# Altium schematic sheet SIM800C_L70.SchDoc
size A3; SheetNumber: 3; SheetTotal: 4
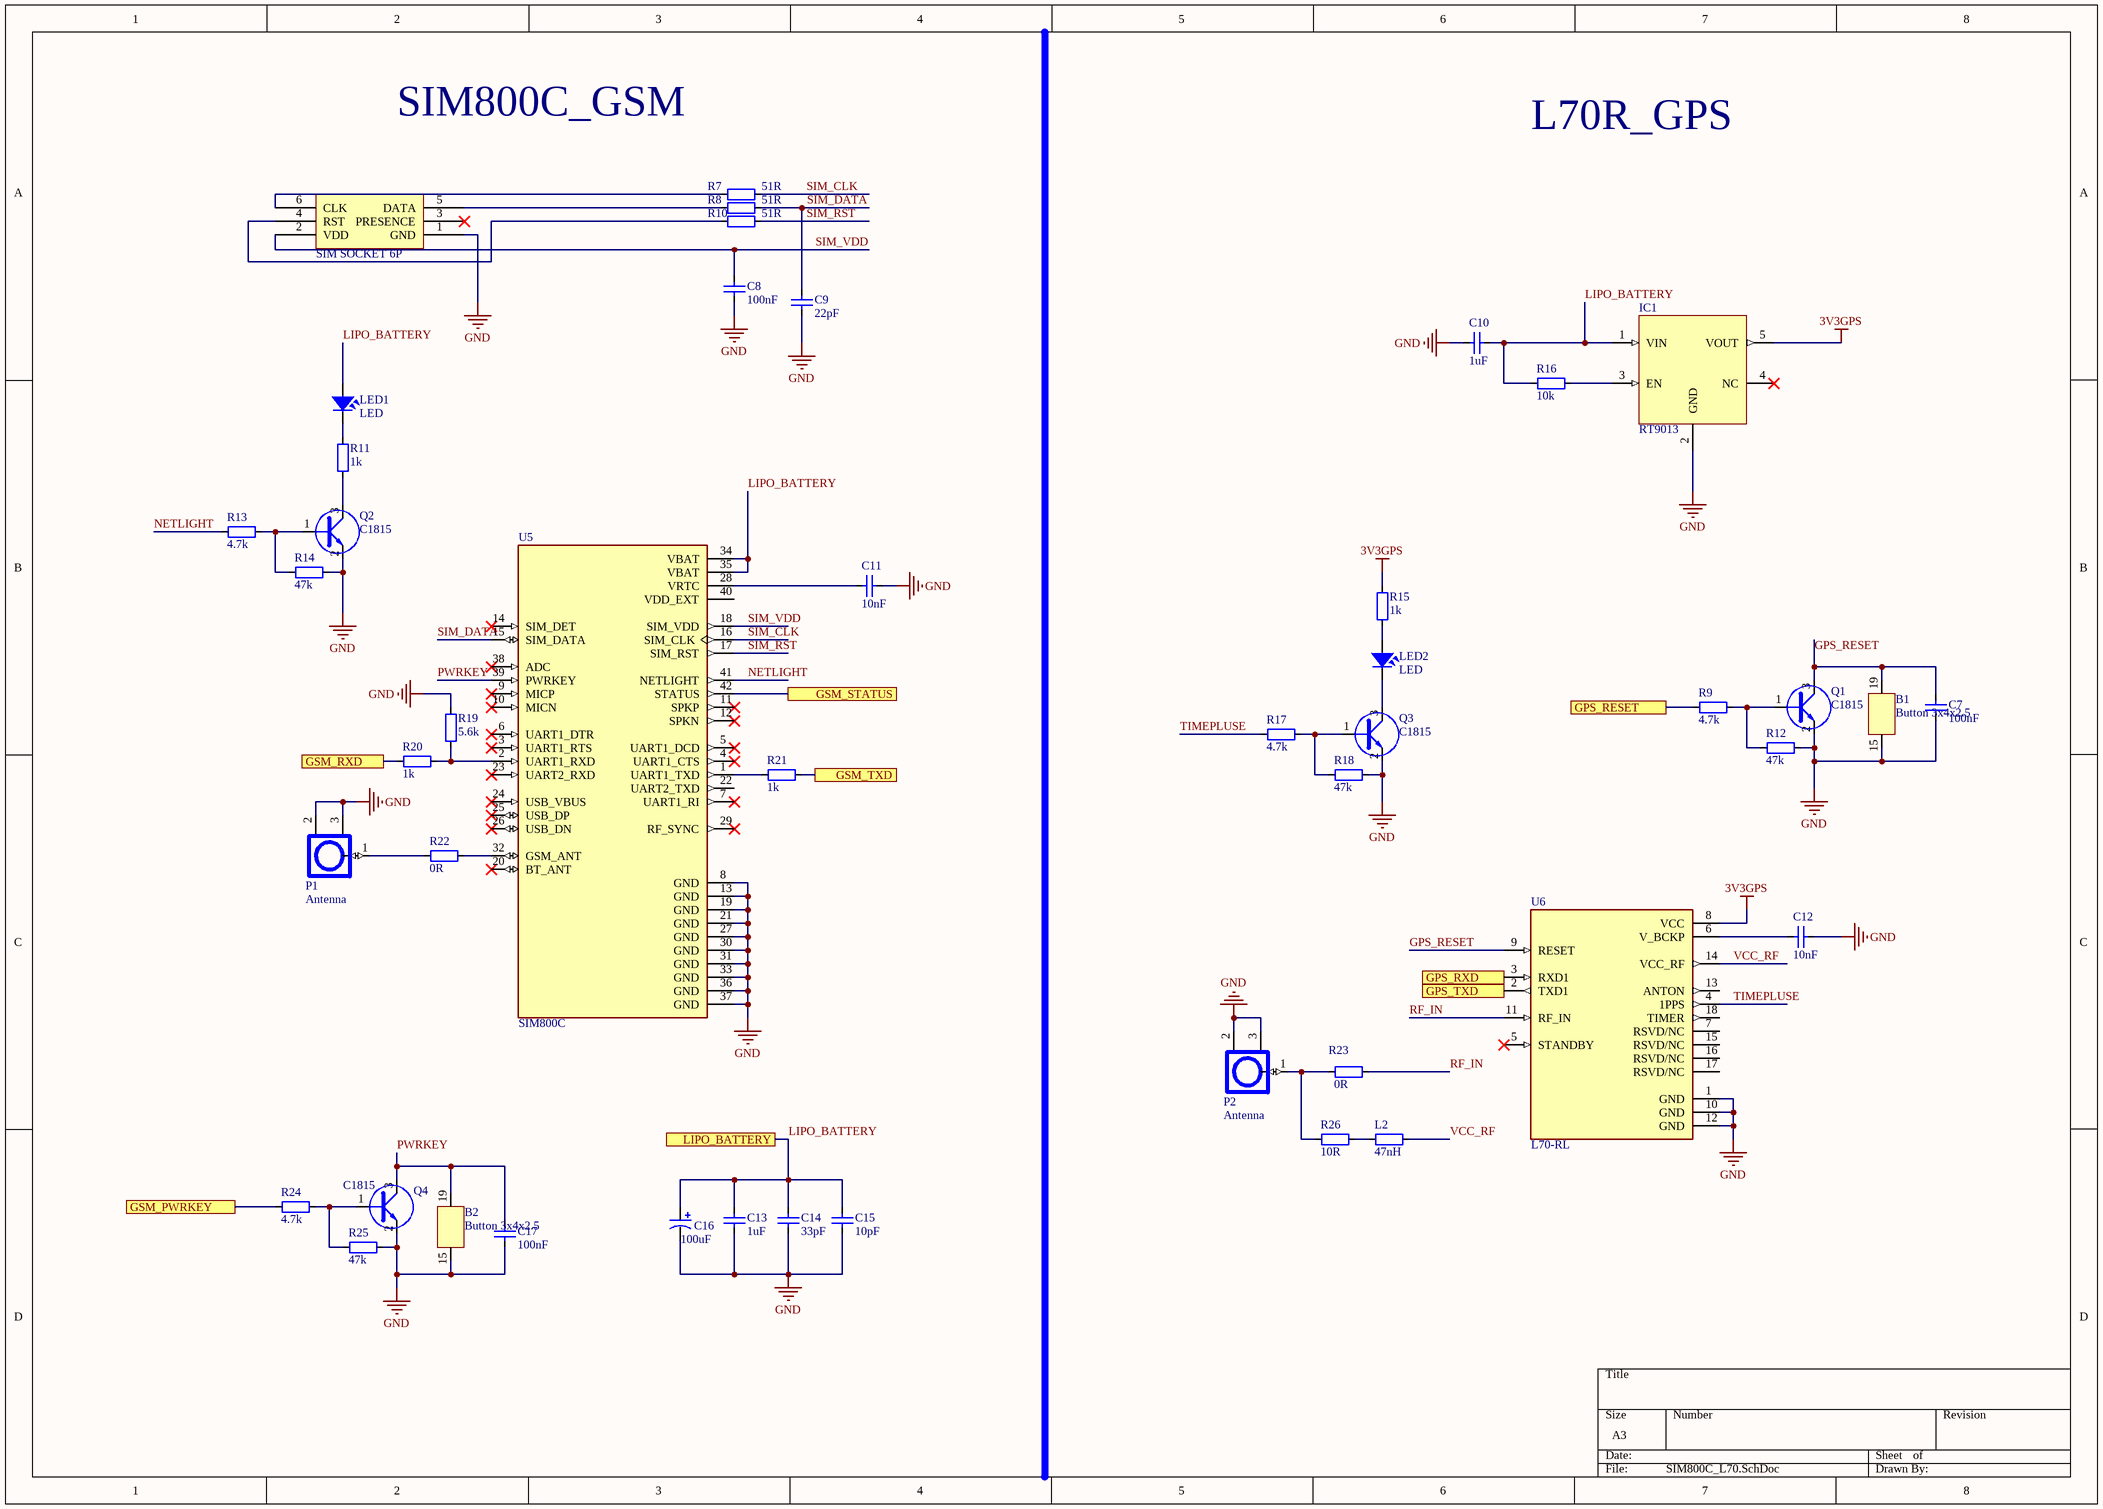
[diagram p0: SIM800C_L70.SchDoc]

## Parts
B1  Button 3x4x2.5  [Button 3x4x2.5]
B2  Button 3x4x2.5  [Button 3x4x2.5]
C7  100nF  [CAP_0805]
C8  100nF  [CAP_0805]
C9  22pF  [CAP_0805]
C10  1uF  [CAP_0805]
C11  10nF  [CAP_0805]
C12  10nF  [CAP_0805]
C13  1uF  [CAP_0805]
C14  33pF  [CAP_0805]
C15  10pF  [CAP_0805]
C16  100uF  [CAP_7343]
C17  100nF  [CAP_0805]
IC1  RT9013  [SOT23-5]
L2  47nH  [RES-SMD-0805]
LED1  LED  [LED-0805-Red]
LED2  LED  [LED-0805-Red]
P1  Antenna  [IPXS]
P2  Antenna  [IPXS]
Q1  C1815  [SOT23D]
Q2  C1815  [SOT23D]
Q3  C1815  [SOT23D]
Q4  C1815  [SOT23D]
R7  51R  [RES-SMD-0805]
R8  51R  [RES-SMD-0805]
R9  4.7k  [RES-SMD-0805]
R10  51R  [RES-SMD-0805]
R11  1k  [RES-SMD-0805]
R12  47k  [RES-SMD-0805]
R13  4.7k  [RES-SMD-0805]
R14  47k  [RES-SMD-0805]
R15  1k  [RES-SMD-0805]
R16  10k  [RES-SMD-0805]
R17  4.7k  [RES-SMD-0805]
R18  47k  [RES-SMD-0805]
R19  5.6k  [RES-SMD-0805]
R20  1k  [RES-SMD-0805]
R21  1k  [RES-SMD-0805]
R22  0R  [RES-SMD-0805]
R23  0R  [RES-SMD-0805]
R24  4.7k  [RES-SMD-0805]
R25  47k  [RES-SMD-0805]
R26  10R  [RES-SMD-0805]
SIM1  SIM SOCKET 6P  [SIM SOCKET 6P]
U5  SIM800C  [LCC110P1570X1760X250-42N]
U6  L70-RL  [XCVR_L70-RL]

## Ports
GPS_RESET, GPS_RXD, GPS_TXD, GSM_PWRKEY, GSM_RXD, GSM_STATUS, GSM_TXD, LIPO_BATTERY

## Nets
3V3GPS: IC1.5(VOUT) R15.2 U6.8(VCC)
GND: B1.15 B2.15 C7.1 C8.2 C9.1 C10.1 C11.2 C12.2 C13.2 C14.2 C15.2 C16.2 C17.1 IC1.2(GND) P1.2 P1.3 P2.2 P2.3 Q1.2(E) Q2.2(E) Q3.2(E) Q4.2(E) R12.2 R14.2 R18.2 R19.1 R25.2 SIM1.1(GND) U5.8(GND) U5.13(GND) U5.19(GND) U5.21(GND) U5.27(GND) U5.30(GND) U5.31(GND) U5.33(GND) U5.36(GND) U5.37(GND) U6.1(GND) U6.10(GND) U6.12(GND)
GPS_RESET: B1.19 C7.2 Q1.3(C) U6.9(RESET)
GPS_RESET: R9.1 ; port GPS_RESET  [a separate net that carries the same name]
GPS_RXD: U6.3(RXD1) ; port GPS_RXD
GPS_TXD: U6.2(TXD1) ; port GPS_TXD
GSM_PWRKEY: R24.1 ; port GSM_PWRKEY
GSM_RXD: R20.1 ; port GSM_RXD
GSM_STATUS: U5.42(STATUS) ; port GSM_STATUS
GSM_TXD: R21.1 ; port GSM_TXD
LIPO_BATTERY: C10.2 C13.1 C14.1 C15.1 C16.1 IC1.1(VIN) LED1.1 R16.2 U5.34(VBAT) U5.35(VBAT) ; port LIPO_BATTERY
NETLIGHT: R13.1 U5.41(NETLIGHT)
PWRKEY: B2.19 C17.2 Q4.3(C) U5.39(PWRKEY)
RF_IN: R23.2 U6.11(RF_IN)
SIM_CLK: R7.2 U5.16(SIM_CLK)
SIM_DATA: C9.2 R8.2 U5.15(SIM_DATA)
SIM_RST: R10.2 U5.17(SIM_RST)
SIM_VDD: C8.1 SIM1.2(VDD) U5.18(SIM_VDD)
TIMEPLUSE: R17.1 U6.4(1PPS)
VCC_RF: L2.2 U6.14(VCC_RF)
NetC11_1: C11.1 U5.28(VRTC)
NetC12_1: C12.1 U6.6(V_BCKP)
NetIC1_3: IC1.3(EN) R16.1
NetL2_1: L2.1 R26.2
NetLED1_2: LED1.2 R11.2
NetLED2_1: LED2.1 R15.1
NetLED2_2: LED2.2 Q3.3(C)
NetP1_1: P1.1 R22.2
NetP2_1: P2.1 R23.1 R26.1
NetQ1_1: Q1.1(B) R9.2 R12.1
NetQ2_1: Q2.1(B) R13.2 R14.1
NetQ2_3: Q2.3(C) R11.1
NetQ3_1: Q3.1(B) R17.2 R18.1
NetQ4_1: Q4.1(B) R24.2 R25.1
NetR7_1: R7.1 SIM1.6(CLK)
NetR8_1: R8.1 SIM1.5(DATA)
NetR10_1: R10.1 SIM1.4(RST)
NetR19_2: R19.2 R20.2 U5.2(UART1_RXD)
NetR21_2: R21.2 U5.1(UART1_TXD)
NetR22_1: R22.1 U5.32(GSM_ANT)

Not connected (* = marked no-connect by the designer): IC1 4(NC)*; SIM1 3(PRESENCE)*; U5 3(UART1_RTS)* 4(UART1_CTS)* 5(UART1_DCD)* 6(UART1_DTR)* 7(UART1_RI)* 9(MICP)* 10(MICN)* 11(SPKP)* 12(SPKN)* 14(SIM_DET)* 20(BT_ANT)* 22(UART2_TXD) 23(UART2_RXD)* 24(USB_VBUS)* 25(USB_DP)* 26(USB_DN)* 29(RF_SYNC)* 38(ADC)* 40(VDD_EXT); U6 5(STANDBY)* 7(RSVD/NC) 13(ANTON) 15(RSVD/NC) 16(RSVD/NC) 17(RSVD/NC) 18(TIMER)

## Notes on the sheet
- SIM800C_GSM
- L70R_GPS

## Library data of the parts
C7-C15 C17 = CapSMD: Capacitor; Value: 33p; Published: 8-Jun-2000; LatestRevisionDate: 17-Jul-2002; LatestRevisionNote: Re-released for DXP Platform.; PackageReference: RAD-0.3; Publisher: Altium Limited
C16 = CAP_TAN_SMD: Polazied Tantalum Capacitor
IC1 = RT9013: RT9013-33GB IC REG LINEAR 3.3V 500mA SOT23-5
L2 R7-R26 = Resistor - SMD: Resistor; Manufacturer: Generic Components; Class: Passive; Published: 08/06/2000; Publisher: Altium Hobart Technology Centre
LED1 LED2 = LED: LED Single colour Green and Red; Value: LED 3 ly Single Colour
P1 P2 = IPXSx66: Antenna GSM GPS
Q1-Q4 = 2SC1815: NPN 600mW, ECB; Value: C1815
SIM1 = SIM SOCKET 6P: Ma_Hang: MH001823; Ten_LK: Socket SIM 6P SK06
U5 = SIM800C: Module: GSM/Bluetooth; GPRS; 2G; 1800MHz, 900MHz; 85.6kbps; SMD; MF: Simcom; MP: SIM800C; Availability: Unavailable; Package: None; Value: *; Price: None; SnapEDA_Link: https://www.snapeda.com/parts/SIM800C/SIMcom%20Wireless%20solutions%20Co.%2CLtd/view-part/571323/?ref=snap
U6 = L70-RL: L70-RL, a low cost ROM-based GPS module, brings the high performance of MTK positioning engine to industrial applications with its compact profile, ultra low power consumption and fast positioning capability; MF: Quectel; Availability: Not in stock; Price: None; Package: None; SnapEDA_Link: https://www.snapeda.com/parts/L70-RL/Quectel/view-part/?ref=snap; MP: L70-RL; Value: *; Check_prices: https://www.snapeda.com/parts/L70-RL/Quectel/view-part/?ref=eda